# EAGLE schematic interface_board (EAGLE 8.0.0)
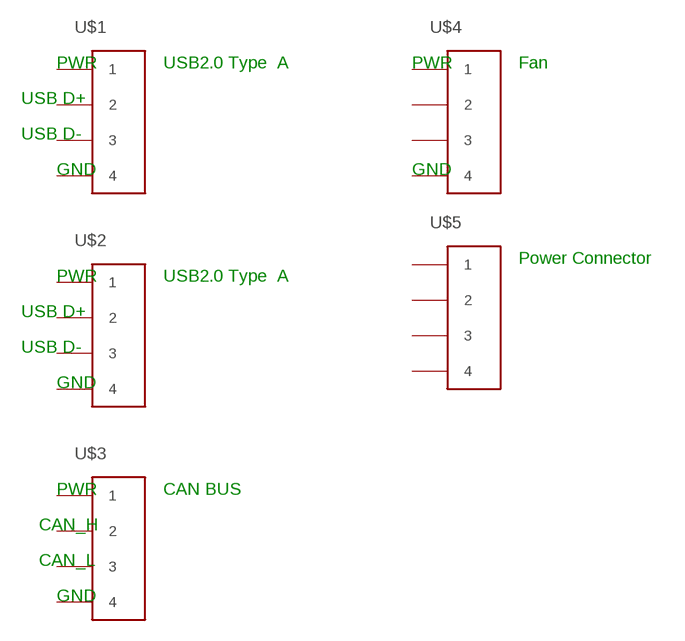
[diagram p0: schematic, sheet 1]

## Parts
U$1  USB_4PIN_VERT  [UE27AE54100]
U$2  USB_4PIN_VERT  [UE27AE54100]
U$3  DF13-4  [DF13-4]
U$4  DF13-4  [DF13-4]
U$5  DF13-4  [DF13-4]
Unconnected: U$1.1 U$1.2 U$1.3 U$1.4 U$2.1 U$2.2 U$2.3 U$2.4 U$3.P$1 U$3.P$2 U$3.P$3 U$3.P$4 U$4.P$1 U$4.P$2 U$4.P$3 U$4.P$4 U$5.P$1 U$5.P$2 U$5.P$3 U$5.P$4

## Notes on the sheet
- PWR | USB2.0 Type  A | PWR | Fan
- USB D+
- USB D-
- GND | GND
- Power Connector
- PWR | USB2.0 Type  A
- USB D+
- USB D-
- GND
- PWR | CAN BUS
- CAN_H
- CAN_L
- GND

## Library data of the parts
U$1 U$2 = connectors:USB_4PIN_VERT: Amphenol USB 4-pin vertical header UE27AE54100 Drawing <https://www.amphenolcanada.com/ProductSearch/drawings/AC/UE27AEX4X0X.pdf>
U$3-U$5 = connectors:DF13-4: Hirose 4-pin vertical header 1.25mm Pitch Miniature Crimping Connector Digikey Product Page <https://www.digikey.com/product-detail/en/DF13-4P-1.25DSA/H2193-ND/241767>